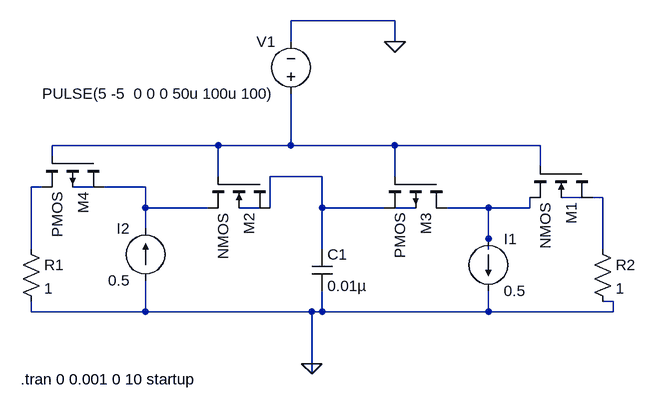
[diagram p0: schematic Ashlesh.asc]
Ashlesh.asc, the LTspice schematic file:
Version 4
SHEET 1 880 680
WIRE 160 -128 0 -128
WIRE 0 -96 0 -128
WIRE 160 -96 160 -128
WIRE -112 64 -368 64
WIRE 0 64 0 -16
WIRE 0 64 -112 64
WIRE 160 64 0 64
WIRE 384 64 160 64
WIRE -368 80 -368 64
WIRE 384 96 384 64
WIRE -112 112 -112 64
WIRE 48 112 -32 112
WIRE 160 112 160 64
WIRE -384 128 -400 128
WIRE -304 128 -336 128
WIRE -224 128 -288 128
WIRE 448 144 416 144
WIRE 480 144 464 144
WIRE -224 160 -224 128
WIRE -128 160 -224 160
WIRE -48 160 -80 160
WIRE -32 160 -32 112
WIRE 48 160 48 112
WIRE 144 160 48 160
WIRE 192 160 160 160
WIRE 304 160 240 160
WIRE 368 160 368 144
WIRE 368 160 304 160
WIRE -224 192 -224 160
WIRE 304 208 304 160
WIRE -400 224 -400 128
WIRE 48 224 48 160
WIRE 304 224 304 208
WIRE 480 224 480 144
WIRE 496 304 480 304
WIRE -400 320 -400 304
WIRE -224 320 -224 272
WIRE -224 320 -400 320
WIRE 32 320 -224 320
WIRE 48 320 48 288
WIRE 48 320 32 320
WIRE 304 320 304 288
WIRE 304 320 48 320
WIRE 496 320 496 304
WIRE 496 320 304 320
WIRE 32 400 32 320
WIRE 32 416 32 400
FLAG 32 400 0
FLAG 160 -96 0
SYMBOL nmos4 464 96 R90
SYMATTR InstName M1
SYMBOL nmos4 -32 112 R90
SYMATTR InstName M2
SYMBOL pmos4 240 112 R90
SYMATTR InstName M3
SYMBOL pmos4 -288 80 R90
SYMATTR InstName M4
SYMBOL cap 32 224 R0
SYMATTR InstName C1
SYMATTR Value 0.01µ
SYMBOL current 304 208 R0
WINDOW 123 0 0 Left 0
WINDOW 39 0 0 Left 0
SYMATTR InstName I1
SYMATTR Value 0.5
SYMBOL current -224 272 R180
WINDOW 0 24 80 Left 2
WINDOW 3 24 0 Left 2
WINDOW 123 0 0 Left 0
WINDOW 39 0 0 Left 0
SYMATTR InstName I2
SYMATTR Value 0.5
SYMBOL res -416 208 R0
SYMATTR InstName R1
SYMATTR Value 1
SYMBOL res 464 208 R0
SYMATTR InstName R2
SYMATTR Value 1
SYMBOL voltage 0 0 R180
WINDOW 0 24 96 Left 2
WINDOW 3 24 16 Left 2
WINDOW 123 0 0 Left 0
WINDOW 39 0 0 Left 0
SYMATTR InstName V1
SYMATTR Value PULSE(5 -5  0 0 0 50u 100u 100)
TEXT -416 424 Left 2 !.tran 0 0.001 0 10 startup

The netlist it stands for:
* Ashlesh.asc
M1 N007 N001 N010 N006 NMOS
M2 N002 N001 N005 N008 NMOS
M3 N010 N001 N002 N009 PMOS
M4 N005 N001 N003 N004 PMOS
C1 N002 0 0.01µ
I1 N010 0 0.5
I2 0 N005 0.5
R1 N003 0 1
R2 N007 0 1
V1 N001 0 PULSE(5 -5  0 0 0 50u 100u 100)
.model NMOS NMOS
.model PMOS PMOS
.lib standard.mos
.tran 0 0.001 0 10 startup
.backanno
.end